# EasyEDA schematic LAMU.json
TITLE: LAMU (Radio Music DX); REV: 1.0; Date: 2022-08-20; Sheet: 1/1; Drawn By: cedric.stoquer; Company: Your Company
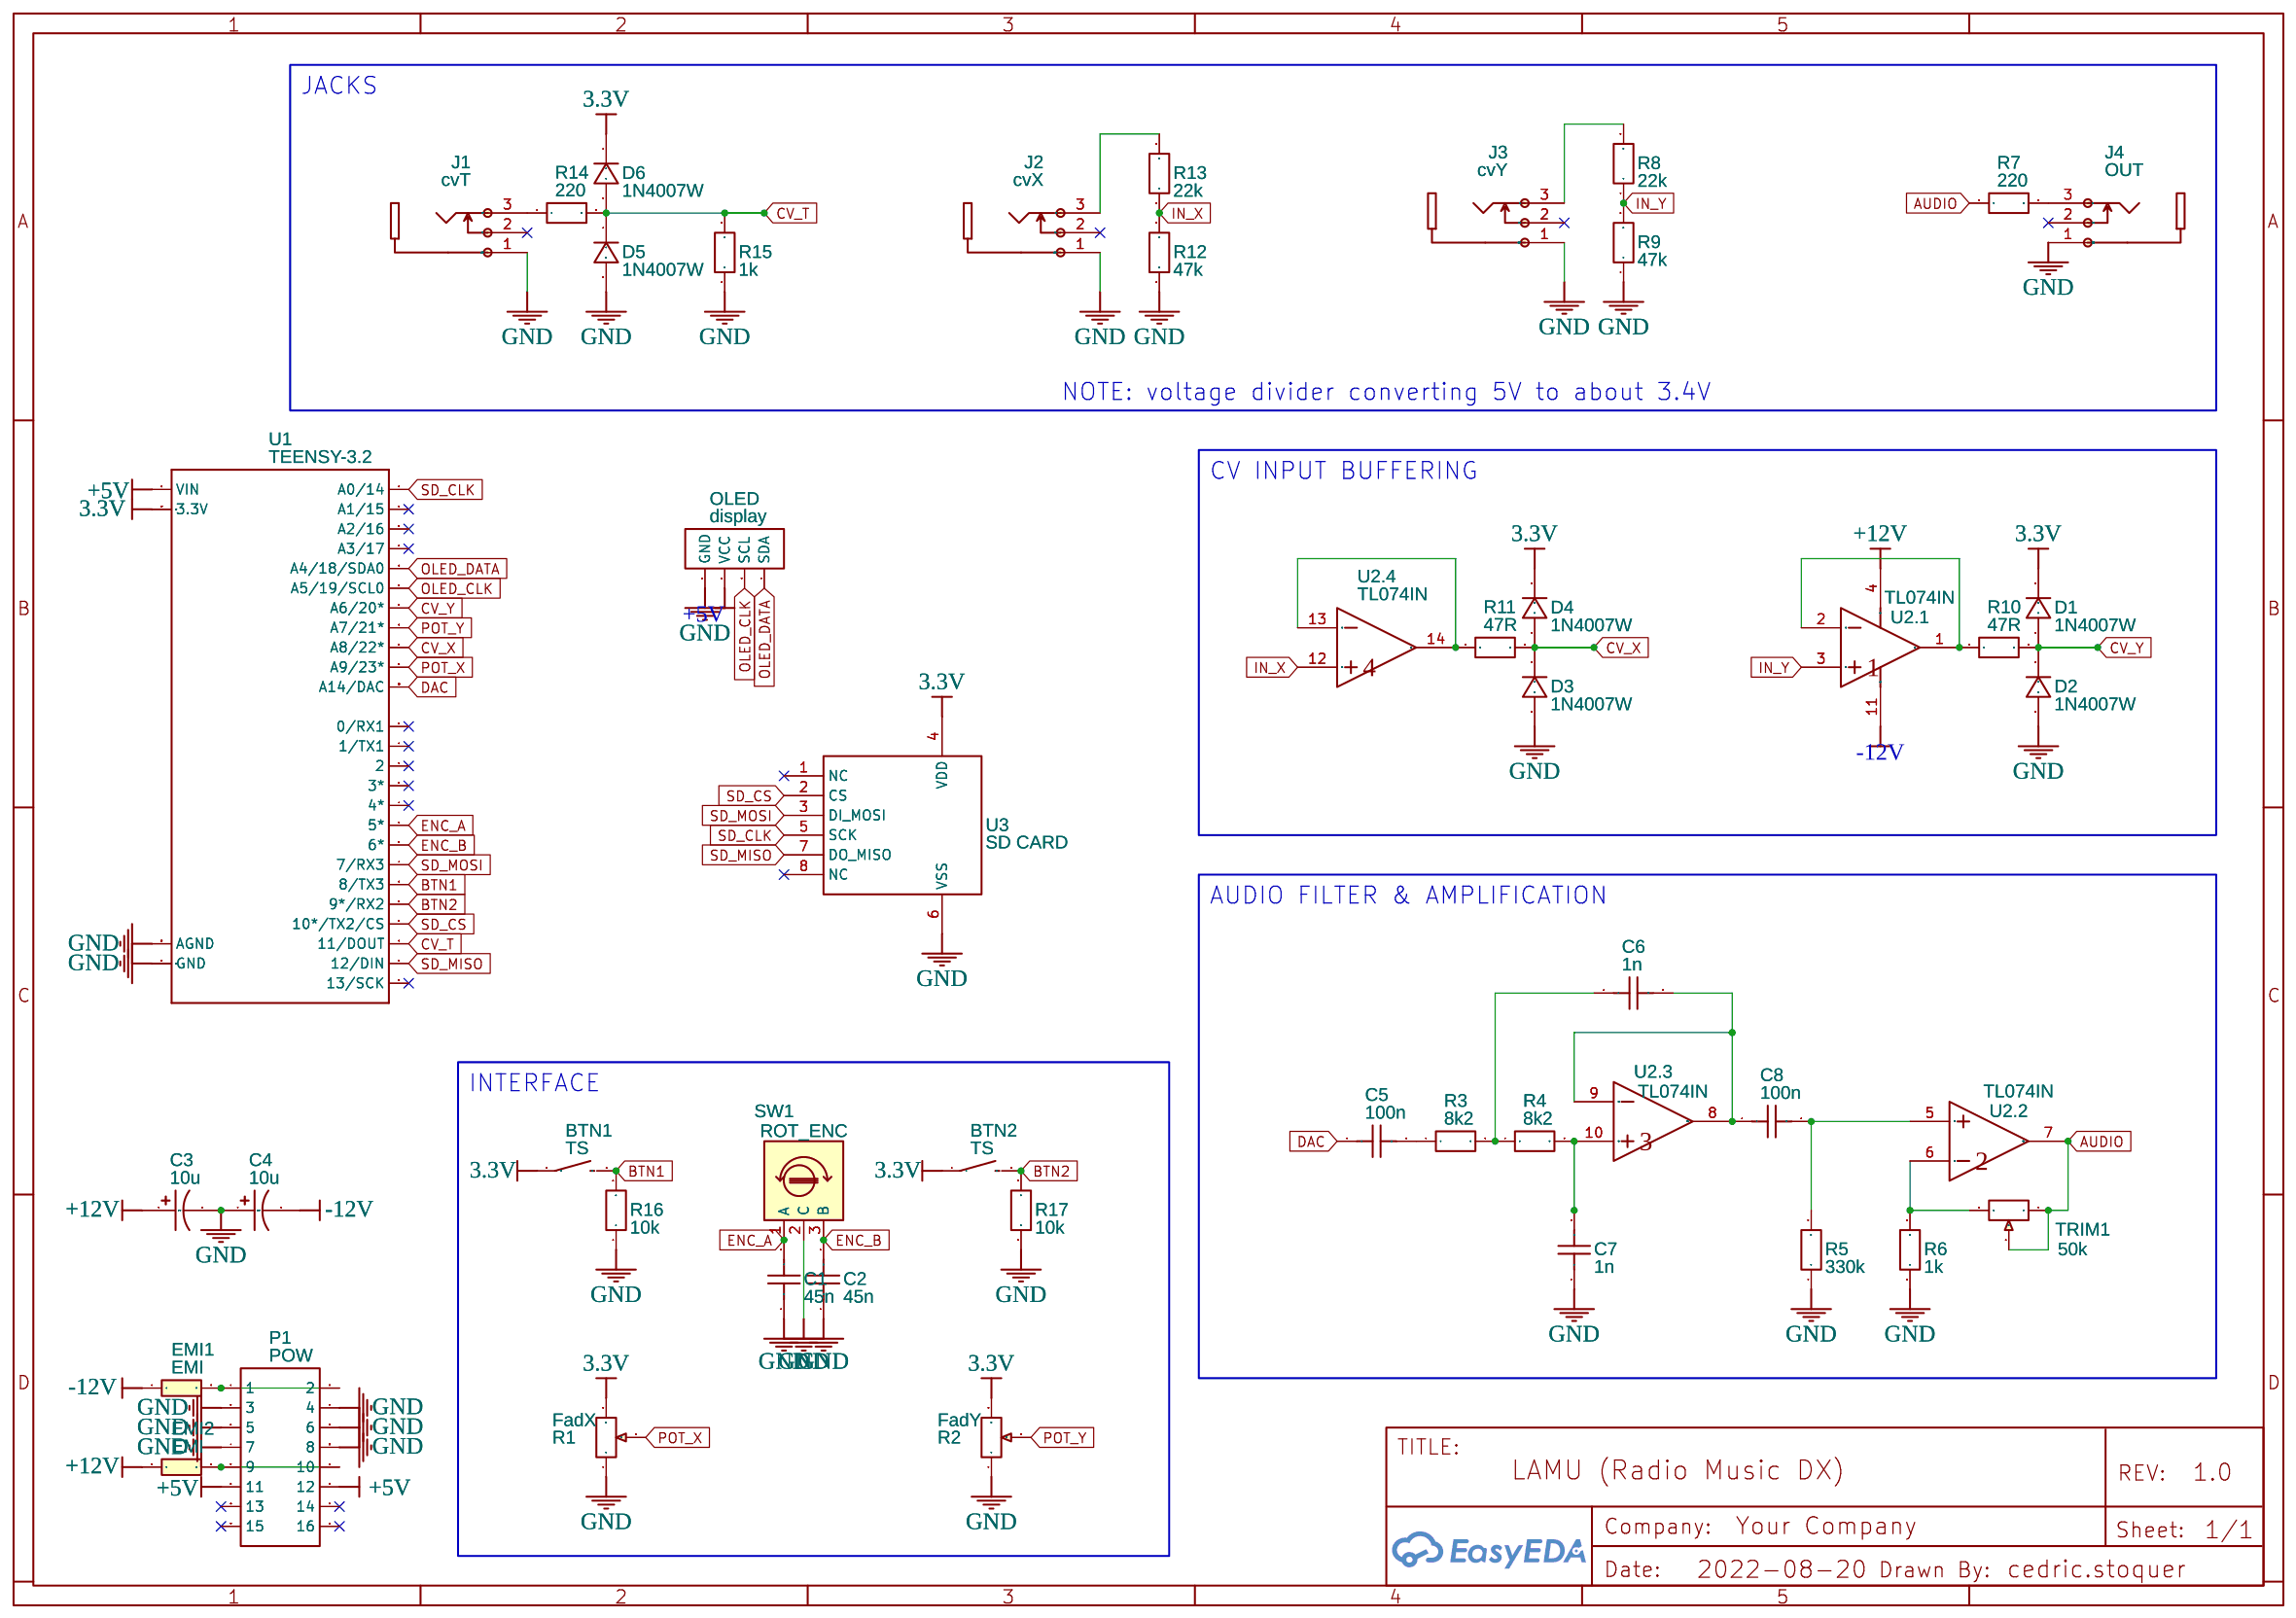
[diagram p0: schematic sheet]

## Parts
BTN1  TS  [SPARKFUN-SWITCHES_TACTILE_SWITCH_PTH_6.0MM]
BTN2  TS  [SPARKFUN-SWITCHES_TACTILE_SWITCH_PTH_6.0MM]
C1  45n  [RAD-0.1]
C2  45n  [RAD-0.1]
C3  10u  [CAP-D5.0×F2.0]
C4  10u  [CAP-D5.0×F2.0]
C5  100n  [RAD-0.1]
C6  1n  [RAD-0.1]
C7  1n  [RAD-0.1]
C8  100n  [RAD-0.1]
D1  1N4007W  [DIODE-1N4148]
D2  1N4007W  [DIODE-1N4148]
D3  1N4007W  [DIODE-1N4148]
D4  1N4007W  [DIODE-1N4148]
D5  1N4007W  [DIODE-1N4148]
D6  1N4007W  [DIODE-1N4148]
EMI1  EMI  [EMI FILTER]
EMI2  EMI  [EMI FILTER]
J1  cvT  [THONKICONN]
J2  cvX  [THONKICONN]
J3  cvY  [THONKICONN]
J4  OUT  [THONKICONN]
OLED  display  [HDR-F-2.54_1X4]
P1  POW  [IDC-TH_16P-P2.54_C3406]
R1  FadX  [BEFACO 30MM SLIDER POTENTIOMETER]
R2  FadY  [BEFACO 30MM SLIDER POTENTIOMETER]
R3  8k2  [VERTICAL RESISTOR]
R4  8k2  [VERTICAL RESISTOR]
R5  330k  [VERTICAL RESISTOR]
R6  1k  [VERTICAL RESISTOR]
R7  220  [VERTICAL RESISTOR]
R8  22k  [VERTICAL RESISTOR]
R9  47k  [VERTICAL RESISTOR]
R10  47R  [VERTICAL RESISTOR]
R11  47R  [VERTICAL RESISTOR]
R12  47k  [VERTICAL RESISTOR]
R13  22k  [VERTICAL RESISTOR]
R14  220  [VERTICAL RESISTOR]
R15  1k  [VERTICAL RESISTOR]
R16  10k  [VERTICAL RESISTOR]
R17  10k  [VERTICAL RESISTOR]
SW1  ROT_ENC  [ENCODER_ALPS-EC12E]
TRIM1  50k  [RES-ADJ-TH_3323P]
U1  TEENSY-3.2  [TEENSY_TEENSY-3.2-PTH]
U2  TL074IN  [PDIP-14_L19.3-W6.4-P2.54-LS7.9-BL-1]  (sections 1,2,3,4)
U3  SD CARD  [PJS008U-3000-0]

## Library data of the parts
BTN1 BTN2 = SPARKFUN-SWITCHES_MOMENTARY-SWITCH-SPST-PTH-6.0MM: Contributor: Owen Pratama
C1 C2 C5-C8 = C_RAD-0.1_US: Contributor: LCEDA_Lib
C3 C4 = CE_TH_D5.0×F2.0_US: Contributor: LCEDA_Lib
D1-D6 = 1N4007W: Supplier: LCSC; Supplier Part: C328592; Manufacturer: BLUE ROCKET; Contributor: LCEDA_Lib
EMI1 EMI2 = L0603_EU: Contributor: LCEDA_Lib
J1-J4 = Thonkiconn: Manufacturer Part: Thonk; Contributor: Tanaisfox
OLED = HDR-F-2.54_1x4: Supplier Part: C225501; Supplier: LCSC; Contributor: LCEDA_Lib
P1 = HDR-IDC-2.54-2X8P: Supplier: LCSC; Manufacturer: BOOMELE; Manufacturer Part: IDC Box 2.54mm 16P　Straight; image: //image.lceda.cn/szlcsc/C3406.jpg; Supplier Part: C3406
R1 R2 = slide volume resistor SL4515N: Contributor: N.Morisaki
R3-R17 = R_AXIAL-0.4_EU: Contributor: LCEDA_Lib
SW1 = Rotary_Encoder: Contributor: KiCAD; license: https://www.gnu.org/licenses/lgpl-2.1.html
TRIM1 = R_3386P_EU: Supplier: LCSC; Contributor: LCEDA_Lib; Value(Ω): 10K
U1 = TEENSY-3.2PTH: Contributor: Von Steuben
U2 = TL074IN: Supplier: LCSC; Supplier Part: C1346811; Manufacturer: TI(德州仪器); subpart_no: 1
U3 = SD CARD READER PJS008U-3000-0: Manufacturer Part: SF72S006VBAR2500; Supplier Part: 670-2799-1-ND; Supplier: Digi-Key; link: https://www.digikey.com/product-detail/en/jae-electronics/SF72S006VBAR2500/670-2799-1-ND/5247732; Contributor: Guest

## Nets
3.3V: BTN1.1 BTN2.1 D1.1 D4.1 D6.1 R1.3 R2.3 U1.3.3V-1(3.3V) U3.4(VDD)
+5V: OLED.2(VCC) P1.11 P1.12 U1.VIN
+12V: C3.1 EMI2.1 U2.4(VCC)
-12V: C4.2 EMI1.1 U2.11(GND)
GND: C1.1 C2.1 C3.2 C4.1 C7.1 D2.2 D3.2 D5.2 J1.1(SLEVE/GND) J2.1(SLEVE/GND) J3.1(SLEVE/GND) J4.1(SLEVE/GND) OLED.1(GND) P1.3 P1.4 P1.5 P1.6 P1.7 P1.8 R1.1 R2.1 R5.1 R6.1 R9.1 R12.1 R15.1 R16.1 R17.1 SW1.2(C) U1.AGND U1.GND1(GND) U3.6(VSS)
AUDIO: R7.1 TRIM1.1 TRIM1.2 U2.7(OUT2)
BTN1: BTN1.3(2) R16.2 U1.8(8/TX3)
BTN2: BTN2.3(2) R17.2 U1.9(9*/RX2)
CV_T: D5.1 D6.2 R14.2 R15.2 U1.11(11/DOUT)
CV_X: D3.1 D4.2 R11.2 U1.22(A8/22*)
CV_Y: D1.2 D2.1 R10.2 U1.20(A6/20*)
DAC: C5.1 U1.A14/DAC
ENC_A: C1.2 SW1.1(A) U1.5(5*)
ENC_B: C2.2 SW1.3(B) U1.6(6*)
IN_X: R12.2 R13.1 U2.12(IN4+)
IN_Y: R8.1 R9.2 U2.3(IN1+)
OLED_CLK: OLED.3(SCL) U1.19(A5/19/SCL0)
OLED_DATA: OLED.4(SDA) U1.18(A4/18/SDA0)
POT_X: R1.2 U1.23(A9/23*)
POT_Y: R2.2 U1.21(A7/21*)
SD_CLK: U1.14(A0/14) U3.5(SCK)
SD_CS: U1.10(10*/TX2/CS) U3.2(CS)
SD_MISO: U1.12(12/DIN) U3.7(DO_MISO)
SD_MOSI: U1.7(7/RX3) U3.3(DI_MOSI)
Net-(C5-2): C5.2 R3.1
Net-(C6-1): C6.1 R3.2 R4.1
Net-(C6-2): C6.2 C8.1 U2.8(OUT3) U2.9(IN3-)
Net-(C7-2): C7.2 R4.2 U2.10(IN3+)
Net-(C8-2): C8.2 R5.2 U2.5(IN2+)
Net-(EMI1-2): EMI1.2 P1.1 P1.2
Net-(EMI2-2): EMI2.2 P1.9 P1.10
Net-(J1-3): J1.3(TIP) R14.1
Net-(J2-3): J2.3(TIP) R13.2
Net-(J3-3): J3.3(TIP) R8.2
Net-(J4-3): J4.3(TIP) R7.2
Net-(R6-2): R6.2 TRIM1.3 U2.6(IN2-)
Net-(R10-1): R10.1 U2.1(OUT1) U2.2(IN1-)
Net-(R11-1): R11.1 U2.13(IN4-) U2.14(OUT4)

Not connected (* = marked no-connect by the designer): J1 2(SWITCH)*; J2 2(SWITCH)*; J3 2(SWITCH)*; J4 2(SWITCH)*; P1 13* 14* 15* 16*; U1 0(0/RX1)* 1(1/TX1)* 2* 3(3*)* 4(4*)* 13(13/SCK)* 15(A1/15)* 16(A2/16)* 17(A3/17)*; U3 1(NC)* 8(NC)*

## Notes on the sheet
- JACKS
- NOTE: voltage divider converting 5V to about 3.4V
- CV INPUT BUFFERING
- AUDIO FILTER & AMPLIFICATION
- INTERFACE
